# EAGLE design falzar_curve_313 (EAGLE 9.6.2)
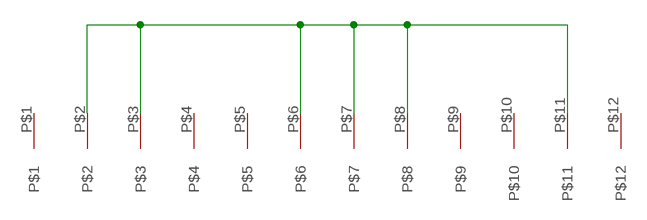
[diagram p0: schematic, sheet 1]

## Parts
U$1  BEAST  [BEAST]

## Nets
N$1: U$1.P$2 U$1.P$3 U$1.P$6 U$1.P$7 U$1.P$8 U$1.P$11
Unconnected: U$1.P$1 U$1.P$4 U$1.P$5 U$1.P$9 U$1.P$10 U$1.P$12

## Library data of the parts
U$1 = beastpins:BEAST

## Board
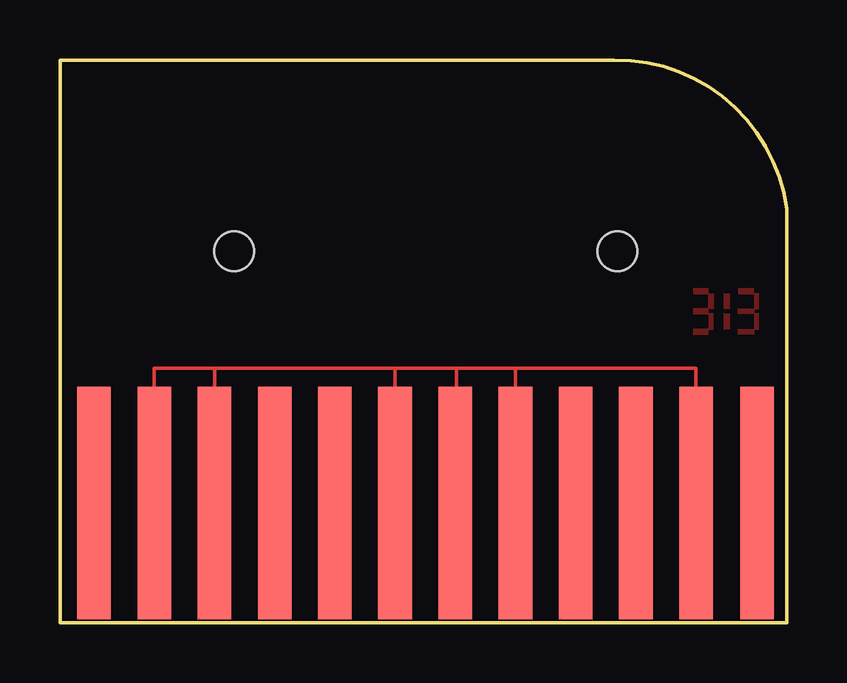
[diagram p1: board, top side]

Size 30.3 x 23.45 mm. Coordinates in mm from the lower left corner, seen from the top.
Outline: 0,0 30.3,0 30.3,17.25 arc83 23.1,23.45 0,23.45 0,0
Copper layers (1*16): Top 0.035mm / dielectric 1.5mm / Bottom 0.035mm
Design rules "default *": minimum track width 6mil, minimum drill 0.35mm, track to track 1mil, track to pad 6mil, pad to pad 6mil, via to via 6mil, smd to smd 6mil, copper to edge 0.002540625mm, drill to drill 1mil, minimum pad ring 10mil, minimum via ring 8mil, stop-mask expansion 4mil, vias tented up to drill 0mil, thermal gap 10mil
Holes 1.65 mm at 7.27,15.49 23.23,15.49

### Footprints (pad centres in the part's own frame; a part is rotated, then mirrored left to right if it is on the bottom)
BEAST = smd 1.4 x 9.7: P$1 -27.61,5.02; P$2 -25.1,5.02; P$3 -22.59,5.02; P$4 -20.08,5.02; P$5 -17.57,5.02; P$6 -15.06,5.02; P$7 -12.55,5.02; P$8 -10.04,5.02; P$9 -7.53,5.02; P$10 -5.02,5.02; P$11 -2.51,5.02; P$12 0.03,5.02

### Placement (x,y rotation side)
U$1  29.03,-0.03 0 top

### Tracks (layer width: path | path; a pad name or v marks a point on that pad's centre or on a via)
N$1
  Top 0.152: 6.44,10.6 13.97,10.6 | U$1.P$11 26.52,10.6 18.99,10.6 | 14,5.02 U$1.P$6 13.97,10.6 | U$1.P$3 6.44,10.6 | U$1.P$2 3.93,10.6 6.44,10.6 | U$1.P$8 18.99,10.6 | 16.53,10.55 16.53,10.6 13.97,10.6 | 16.53,10.55 16.53,5.04 U$1.P$7 | 18.99,10.6 16.58,10.6 16.53,10.55
N$2
  pour Top: 27.24,13.08 27.05,13.08 27.05,13.72 27.24,13.72
N$3
  pour Top: 26.4,13.08 26.4,12.87 27.03,12.87 27.03,13.08
N$4
  pour Top: 26.4,13.93 26.4,13.72 27.03,13.72 27.03,13.93
N$5
  pour Top: 27.91,13.08 27.7,13.08 27.7,13.72 27.91,13.72
N$6
  pour Top: 27.91,12.24 27.7,12.24 27.7,12.87 27.91,12.87
N$7
  pour Top: 27.05,12.87 27.05,12.24 27.24,12.24 27.24,12.87
N$8
  pour Top: 26.4,12.24 26.4,12.03 27.03,12.03 27.03,12.24
N$9
  pour Top: 28.29,13.93 28.29,13.72 28.92,13.72 28.92,13.93
N$10
  pour Top: 28.92,12.03 28.29,12.03 28.29,12.24 28.92,12.24
N$11
  pour Top: 28.94,12.87 28.94,12.24 29.13,12.24 29.13,12.87
N$12
  pour Top: 28.92,12.87 28.29,12.87 28.29,13.09 28.92,13.09
N$13
  pour Top: 28.94,13.72 28.94,13.09 29.13,13.09 29.13,13.72